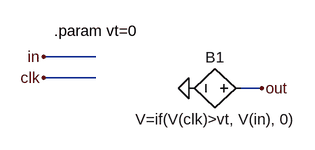
[diagram p0: schematic return_to_zero.asc]
return_to_zero.asc, the LTspice schematic file:
Version 4
SHEET 1 880 680
WIRE 192 96 112 96
WIRE 192 128 112 128
WIRE 448 144 416 144
FLAG 112 96 in
FLAG 112 128 clk
FLAG 448 144 out
FLAG 336 144 0
SYMBOL bv 432 144 R90
WINDOW 0 -32 56 VBottom 2
WINDOW 3 32 56 VTop 2
SYMATTR InstName B1
SYMATTR Value V=if(V(clk)>vt, V(in), 0)
TEXT 128 56 Left 2 !.param vt=0

The netlist it stands for:
* return_to_zero.asc
B1 out 0 V=if(V(clk)>vt, V(in), 0)
.param vt=0
.backanno
.end